# Altium schematic sheet Rear_Tail_Lights_FULL.SchDoc: Rear_Tail_Lights
size A4; SheetNumber: 1; SheetTotal: 1; PageSetup: Record=PageOptions|CenterHorizontal=True|CenterVertical=True|PrintScale=0.63|XCorrection=1.00|YCorrection=1.00|PrintKind=0|BorderSize=5000000|LeftOffset=0|BottomOffset=0|Orientation=2|PaperLength=2794|PaperWidth=4318|Scale=100|PaperSource=7|PrintQuality=600|MediaType=1|DitherType=10|PaperKind=Legal (8 ½ x 14 in)|PrintScaleMode=1
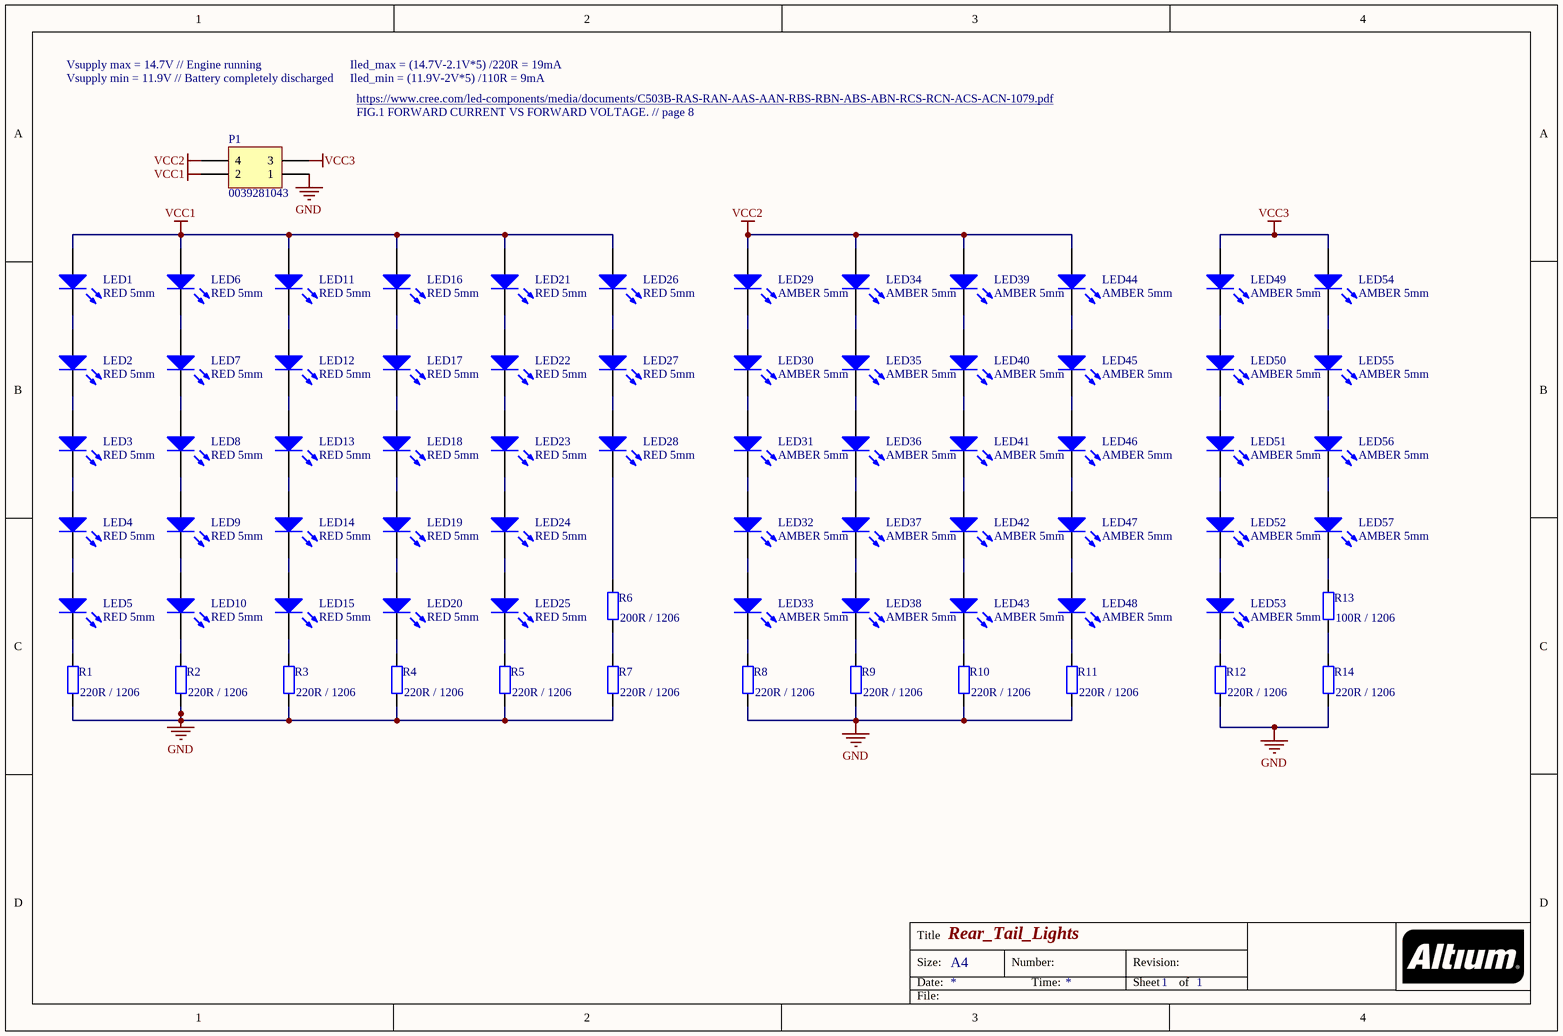
[diagram p0: Rear_Tail_Lights_FULL.SchDoc]

## Parts
LED1  RED 5mm  [LED_5MM_RED_1C-2A]
LED2  RED 5mm  [LED_5MM_RED_1C-2A]
LED3  RED 5mm  [LED_5MM_RED_1C-2A]
LED4  RED 5mm  [LED_5MM_RED_1C-2A]
LED5  RED 5mm  [LED_5MM_RED_1C-2A]
LED6  RED 5mm  [LED_5MM_RED_1C-2A]
LED7  RED 5mm  [LED_5MM_RED_1C-2A]
LED8  RED 5mm  [LED_5MM_RED_1C-2A]
LED9  RED 5mm  [LED_5MM_RED_1C-2A]
LED10  RED 5mm  [LED_5MM_RED_1C-2A]
LED11  RED 5mm  [LED_5MM_RED_1C-2A]
LED12  RED 5mm  [LED_5MM_RED_1C-2A]
LED13  RED 5mm  [LED_5MM_RED_1C-2A]
LED14  RED 5mm  [LED_5MM_RED_1C-2A]
LED15  RED 5mm  [LED_5MM_RED_1C-2A]
LED16  RED 5mm  [LED_5MM_RED_1C-2A]
LED17  RED 5mm  [LED_5MM_RED_1C-2A]
LED18  RED 5mm  [LED_5MM_RED_1C-2A]
LED19  RED 5mm  [LED_5MM_RED_1C-2A]
LED20  RED 5mm  [LED_5MM_RED_1C-2A]
LED21  RED 5mm  [LED_5MM_RED_1C-2A]
LED22  RED 5mm  [LED_5MM_RED_1C-2A]
LED23  RED 5mm  [LED_5MM_RED_1C-2A]
LED24  RED 5mm  [LED_5MM_RED_1C-2A]
LED25  RED 5mm  [LED_5MM_RED_1C-2A]
LED26  RED 5mm  [LED_5MM_RED_1C-2A]
LED27  RED 5mm  [LED_5MM_RED_1C-2A]
LED28  RED 5mm  [LED_5MM_RED_1C-2A]
LED29  AMBER 5mm  [LED_5MM_YELLOW_1C-2A]
LED30  AMBER 5mm  [LED_5MM_YELLOW_1C-2A]
LED31  AMBER 5mm  [LED_5MM_YELLOW_1C-2A]
LED32  AMBER 5mm  [LED_5MM_YELLOW_1C-2A]
LED33  AMBER 5mm  [LED_5MM_YELLOW_1C-2A]
LED34  AMBER 5mm  [LED_5MM_YELLOW_1C-2A]
LED35  AMBER 5mm  [LED_5MM_YELLOW_1C-2A]
LED36  AMBER 5mm  [LED_5MM_YELLOW_1C-2A]
LED37  AMBER 5mm  [LED_5MM_YELLOW_1C-2A]
LED38  AMBER 5mm  [LED_5MM_YELLOW_1C-2A]
LED39  AMBER 5mm  [LED_5MM_YELLOW_1C-2A]
LED40  AMBER 5mm  [LED_5MM_YELLOW_1C-2A]
LED41  AMBER 5mm  [LED_5MM_YELLOW_1C-2A]
LED42  AMBER 5mm  [LED_5MM_YELLOW_1C-2A]
LED43  AMBER 5mm  [LED_5MM_YELLOW_1C-2A]
LED44  AMBER 5mm  [LED_5MM_YELLOW_1C-2A]
LED45  AMBER 5mm  [LED_5MM_YELLOW_1C-2A]
LED46  AMBER 5mm  [LED_5MM_YELLOW_1C-2A]
LED47  AMBER 5mm  [LED_5MM_YELLOW_1C-2A]
LED48  AMBER 5mm  [LED_5MM_YELLOW_1C-2A]
LED49  AMBER 5mm  [LED_5MM_YELLOW_1C-2A]
LED50  AMBER 5mm  [LED_5MM_YELLOW_1C-2A]
LED51  AMBER 5mm  [LED_5MM_YELLOW_1C-2A]
LED52  AMBER 5mm  [LED_5MM_YELLOW_1C-2A]
LED53  AMBER 5mm  [LED_5MM_YELLOW_1C-2A]
LED54  AMBER 5mm  [LED_5MM_YELLOW_1C-2A]
LED55  AMBER 5mm  [LED_5MM_YELLOW_1C-2A]
LED56  AMBER 5mm  [LED_5MM_YELLOW_1C-2A]
LED57  AMBER 5mm  [LED_5MM_YELLOW_1C-2A]
P1  0039281043  [0039281043]
R1  220R / 1206  [RESC3216X70N]
R2  220R / 1206  [RESC3216X70N]
R3  220R / 1206  [RESC3216X70N]
R4  220R / 1206  [RESC3216X70N]
R5  220R / 1206  [RESC3216X70N]
R6  200R / 1206  [RESC3216X70N]
R7  220R / 1206  [RESC3216X70N]
R8  220R / 1206  [RESC3216X70N]
R9  220R / 1206  [RESC3216X70N]
R10  220R / 1206  [RESC3216X70N]
R11  220R / 1206  [RESC3216X70N]
R12  220R / 1206  [RESC3216X70N]
R13  100R / 1206  [RESC3216X70N]
R14  220R / 1206  [RESC3216X70N]

## Nets
GND: P1.1 R1.2 R2.2 R3.2 R4.2 R5.2 R7.2 R8.2 R9.2 R10.2 R11.2 R12.2 R14.2
VCC1: LED1.2(A) LED6.2(A) LED11.2(A) LED16.2(A) LED21.2(A) LED26.2(A) P1.2
VCC2: LED29.2(A) LED34.2(A) LED39.2(A) LED44.2(A) P1.4
VCC3: LED49.2(A) LED54.2(A) P1.3
NetLED1_1: LED1.1(K) LED2.2(A)
NetLED2_1: LED2.1(K) LED3.2(A)
NetLED3_1: LED3.1(K) LED4.2(A)
NetLED4_1: LED4.1(K) LED5.2(A)
NetLED5_1: LED5.1(K) R1.1
NetLED6_1: LED6.1(K) LED7.2(A)
NetLED7_1: LED7.1(K) LED8.2(A)
NetLED8_1: LED8.1(K) LED9.2(A)
NetLED9_1: LED9.1(K) LED10.2(A)
NetLED10_1: LED10.1(K) R2.1
NetLED11_1: LED11.1(K) LED12.2(A)
NetLED12_1: LED12.1(K) LED13.2(A)
NetLED13_1: LED13.1(K) LED14.2(A)
NetLED14_1: LED14.1(K) LED15.2(A)
NetLED15_1: LED15.1(K) R3.1
NetLED16_1: LED16.1(K) LED17.2(A)
NetLED17_1: LED17.1(K) LED18.2(A)
NetLED18_1: LED18.1(K) LED19.2(A)
NetLED19_1: LED19.1(K) LED20.2(A)
NetLED20_1: LED20.1(K) R4.1
NetLED21_1: LED21.1(K) LED22.2(A)
NetLED22_1: LED22.1(K) LED23.2(A)
NetLED23_1: LED23.1(K) LED24.2(A)
NetLED24_1: LED24.1(K) LED25.2(A)
NetLED25_1: LED25.1(K) R5.1
NetLED26_1: LED26.1(K) LED27.2(A)
NetLED27_1: LED27.1(K) LED28.2(A)
NetLED28_1: LED28.1(K) R6.1
NetLED29_1: LED29.1(K) LED30.2(A)
NetLED30_1: LED30.1(K) LED31.2(A)
NetLED31_1: LED31.1(K) LED32.2(A)
NetLED32_1: LED32.1(K) LED33.2(A)
NetLED33_1: LED33.1(K) R8.1
NetLED34_1: LED34.1(K) LED35.2(A)
NetLED35_1: LED35.1(K) LED36.2(A)
NetLED36_1: LED36.1(K) LED37.2(A)
NetLED37_1: LED37.1(K) LED38.2(A)
NetLED38_1: LED38.1(K) R9.1
NetLED39_1: LED39.1(K) LED40.2(A)
NetLED40_1: LED40.1(K) LED41.2(A)
NetLED41_1: LED41.1(K) LED42.2(A)
NetLED42_1: LED42.1(K) LED43.2(A)
NetLED43_1: LED43.1(K) R10.1
NetLED44_1: LED44.1(K) LED45.2(A)
NetLED45_1: LED45.1(K) LED46.2(A)
NetLED46_1: LED46.1(K) LED47.2(A)
NetLED47_1: LED47.1(K) LED48.2(A)
NetLED48_1: LED48.1(K) R11.1
NetLED49_1: LED49.1(K) LED50.2(A)
NetLED50_1: LED50.1(K) LED51.2(A)
NetLED51_1: LED51.1(K) LED52.2(A)
NetLED52_1: LED52.1(K) LED53.2(A)
NetLED53_1: LED53.1(K) R12.1
NetLED54_1: LED54.1(K) LED55.2(A)
NetLED55_1: LED55.1(K) LED56.2(A)
NetLED56_1: LED56.1(K) LED57.2(A)
NetLED57_1: LED57.1(K) R13.1
NetR6_2: R6.2 R7.1
NetR13_2: R13.2 R14.1

## Notes on the sheet
- Vsupply max = 14.7V // Engine running
- Vsupply min = 11.9V // Battery completely discharged
- Iled_max = (14.7V-2.1V*5) /220R = 19mA
- Iled_min = (11.9V-2V*5) /110R = 9mA
- https://www.cree.com/led-components/media/documents/C503B-RAS-RAN-AAS-AAN-RBS-RBN-ABS-ABN-RCS-RCN-ACS-ACN-1079.pdf
- FIG.1 FORWARD CURRENT VS FORWARD VOLTAGE. // page 8
- Title
- Size:
- Date:
- A4
- Number:
- Time:
- Revision:
- Sheet
- of
- File:

## Library data of the parts
LED1-LED57 = LED0: LED GREEN CLEAR 0603 SMD; MANUFACTURER: Lite-On Inc.; Manufacturer PN: LTST-C191KRKT; Published: 8-Jun-2000; PackageReference: LED-0; Publisher: Altium Limited; PackageDescription: LED; 2 Leads
P1 = Header 2X2: Header, 2-Pin, Dual row; LatestRevisionDate: 17-Jul-2002; LatestRevisionNote: Re-released for DXP Platform.; Publisher: Altium Limited
R1-R14 = R_EU: Resistor; LatestRevisionDate: 27-Jul-20  -  Semtech